# Altium schematic sheet CAN_TJA1050_Page1.SchDoc
size A4
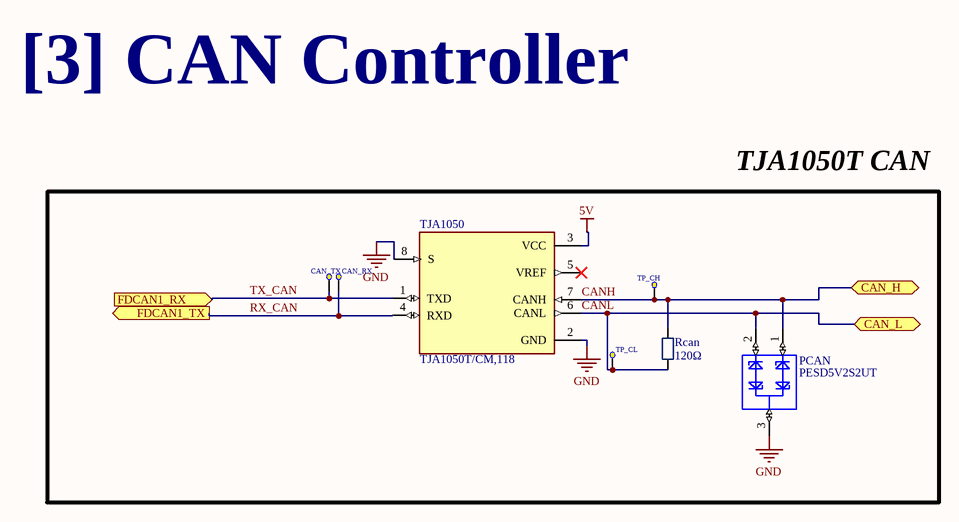
[diagram p0: CAN_TJA1050_Page1.SchDoc]

## Parts
CAN_RX  (no value)  [TestPoint]  (no BOM)
CAN_TX  (no value)  [TestPoint]  (no BOM)
PCAN  PESD5V2S2UT  [PEDS1CAN]
Rcan  120Ω  [Resistor_0805_Generic]
TJA1050  TJA1050T/CM,118  [TJA1050T]
TP_CH  (no value)  [TestPoint]  (no BOM)
TP_CL  (no value)  [TestPoint]  (no BOM)

## Blocks framed on the sheet
TJA1050T CAN: CAN_RX CAN_TX PCAN Rcan TJA1050 TP_CH TP_CL

## Ports
CAN_H (bidir), CAN_L (bidir), FDCAN1_RX (in), FDCAN1_TX (out)

## Nets
5V: TJA1050.3(VCC)
GND: PCAN.3 TJA1050.2(GND) TJA1050.8(S)
CANH: PCAN.1 Rcan.2 TJA1050.7(CANH) TP_CH.1(Test_Point) ; port CAN_H
CANL: PCAN.2 Rcan.1 TJA1050.6(CANL) TP_CL.1(Test_Point) ; port CAN_L
RX_CAN: CAN_RX.1(Test_Point) TJA1050.4(RXD) ; port FDCAN1_TX
TX_CAN: CAN_TX.1(Test_Point) TJA1050.1(TXD) ; port FDCAN1_RX

Not connected (* = marked no-connect by the designer): TJA1050 5(VREF)*

## Notes on the sheet
- [3] CAN Controller

## Library data of the parts
CAN_RX CAN_TX TP_CH TP_CL = TestPoint
PCAN = PESDCAN: ESD Protection Diodes / TVS Diodes PESD5V2S2UT/SOT23/TO-236AB; MF: Nexperia USA; MP: PESD1CAN; Availability: Unavailable; SnapEDA_Link: https://www.snapeda.com/parts/PESD1CAN/Nexperia%20USA%20Inc./view-part/2164340/?ref=snap; Price: None; Package: SOT-323 Nexperia USA; Value: *
Rcan = Resistor_0805: 120Ω +-0.5%; 400V; 0805
TJA1050 = TJA1050T/CM,118: 1/1 Transceiver Half CANbus 8-SO; MF: NXP USA; SnapEDA_Link: https://www.snapeda.com/parts/TJA1050T/CM,118/NXP%20USA%20Inc./view-part/304529/?ref=snap; Value: *; Purchase-URL: https://pricing.snapeda.com/search/part/TJA1050T/CM,118/?ref=eda; Check_prices: https://www.snapeda.com/parts/TJA1050T/CM,118/NXP%20USA%20Inc./view-part/304529/?ref=eda; Price: None; Availability: In Stock; MP: TJA1050T/CM,118; Package: SO-8 NXP Semiconductors